# Altium project DAQ_REV_B.PrjPcb
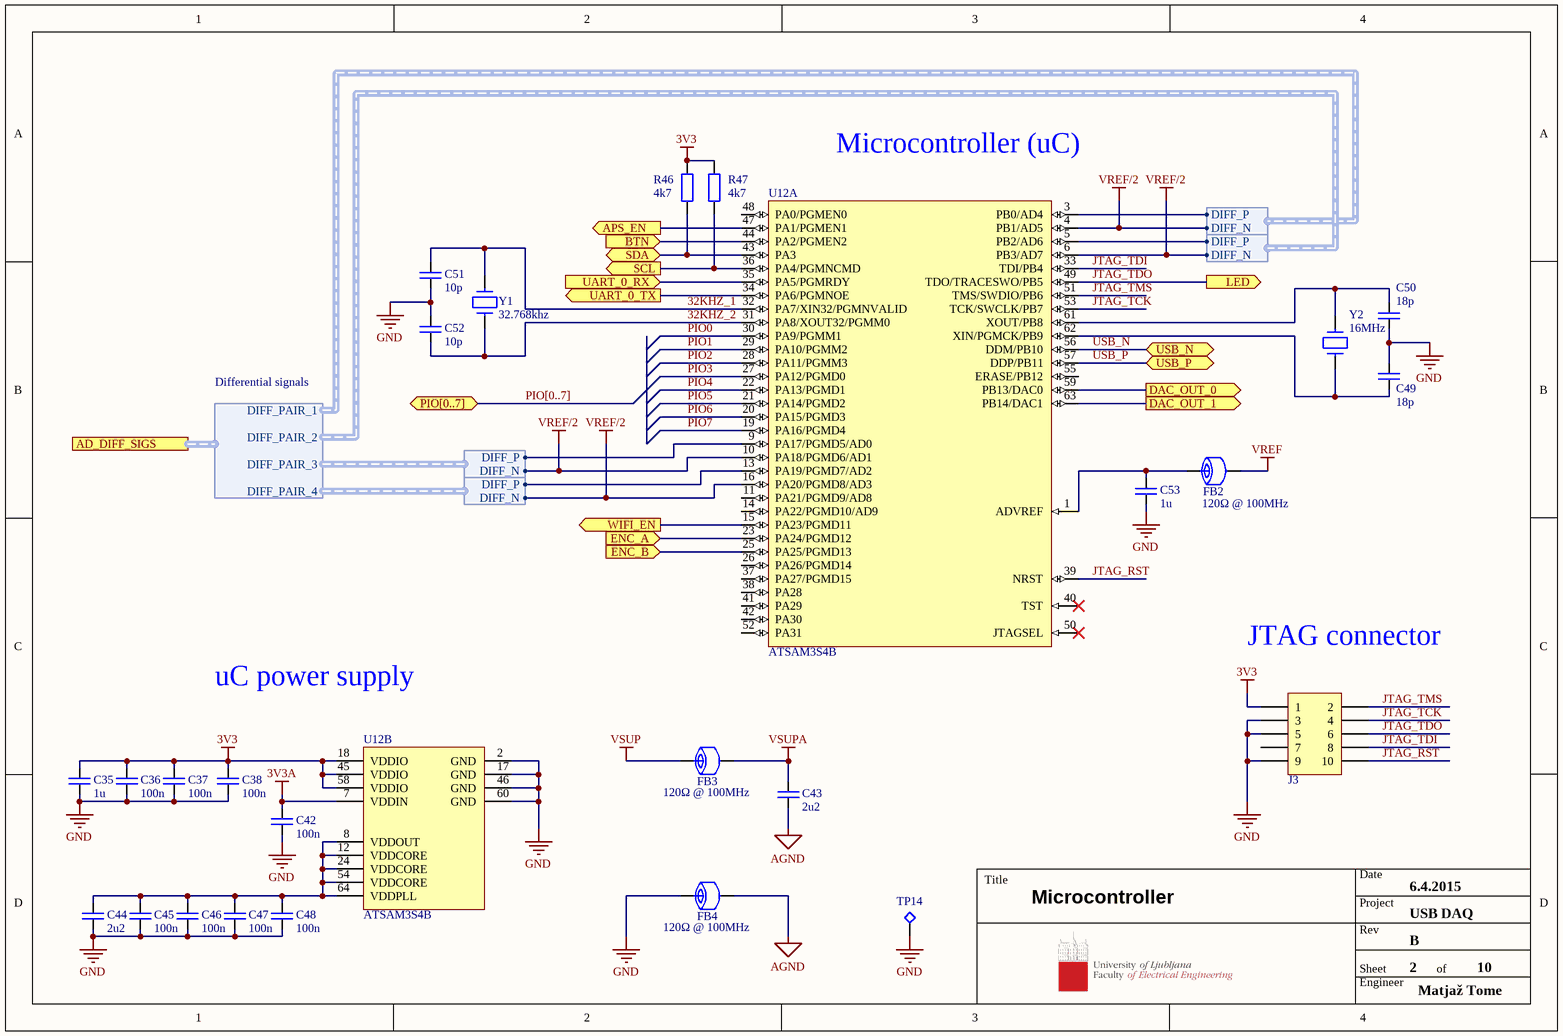
[diagram p0: Microcontroller.SchDoc]
4 sheets, 61 parts. Net scope: flat (ports and power ports of the same name join across sheets).
Board file: DAQ.PcbDoc
Sheets:
  Microcontroller.SchDoc
  Interfaces.SchDoc
  Output_amplifier.SchDoc
  Reference_voltage.SchDoc

## Sheet Microcontroller.SchDoc: Microcontroller
size A4; Date: 6.4.2015; Engineer: Matjaž Tome; DocumentNumber: 4; Revision: B; SheetNumber: 2; SheetTotal: 10; Project: USB DAQ

### Parts
C35  value 1u  [C_0603]  (hidden comment: comment)
C36  value 100n  [C_0603]  (hidden comment: comment)
C37  value 100n  [C_0603]  (hidden comment: comment)
C38  value 100n  [C_0603]  (hidden comment: comment)
C42  value 100n  [C_0603]  (hidden comment: comment)
C43  value 2u2  [C_0603]  (hidden comment: comment)
C44  value 2u2  [C_0603]  (hidden comment: comment)
C45  value 100n  [C_0603]  (hidden comment: comment)
C46  value 100n  [C_0603]  (hidden comment: comment)
C47  value 100n  [C_0603]  (hidden comment: comment)
C48  value 100n  [C_0603]  (hidden comment: comment)
C49  value 18p  [C_0603]  (hidden comment: comment)
C50  value 18p  [C_0603]  (hidden comment: comment)
C51  value 10p  [C_0603]  (hidden comment: comment)
C52  value 10p  [C_0603]  (hidden comment: comment)
C53  value 1u  [C_0603]  (hidden comment: comment)
FB2  120Ω @ 100MHz  [SMD_0805]
FB3  120Ω @ 100MHz  [SMD_0805]
FB4  120Ω @ 100MHz  [SMD_0805]
J3  M50-3600542  [HEADER_2X05_1.27mm]  (value not drawn)
R46  value 4k7  [R_0603]  (hidden comment: comment)
R47  value 4k7  [R_0603]  (hidden comment: comment)
TP14  testpoint  [TP1_FULL]  (value not drawn)
U12  ATSAM3S4B  [LQFP64]  (parts A,B of 2)
Y1  32.768khz  [2X6_FLAT]
Y2  16MHz  [5X3.2]

### Ports
AD_DIFF_SIGS (harness Differential signals), APS_EN (out), BTN (in), DAC_OUT_0 (out), DAC_OUT_1 (out), ENC_A (in), ENC_B (in), LED (out), PIO[0..7] (bidir), SCL (out), SDA (bidir), UART_0_RX (in), UART_0_TX (out), USB_N (bidir), USB_P (bidir), WIFI_EN (out)

### Harnesses
Differential pair: DIFF_P, DIFF_N
Differential signals: DIFF_PAIR_1, DIFF_PAIR_2, DIFF_PAIR_3, DIFF_PAIR_4

### Nets
3V3: C35.1 C36.1 C37.1 C38.1 J3.1 R46.2 R47.2 U12.18(VDDIO) U12.45(VDDIO) U12.58(VDDIO)
3V3A: C42.1 U12.7(VDDIN)
AGND: C43.2 FB4.2
GND: C35.2 C36.2 C37.2 C38.2 C42.2 C44.2 C45.2 C46.2 C47.2 C48.2 C49.2 C50.2 C51.2 C52.2 C53.2 FB4.1 J3.3 J3.5 J3.9 TP14.1 U12.2(GND) U12.17(GND) U12.46(GND) U12.60(GND)
VREF: FB2.2
VREF/2: U12.4(PB1/AD5) U12.6(PB3/AD7) U12.10(PA18/PGMD6/AD1) U12.16(PA20/PGMD8/AD3) ; harness Differential pair.DIFF_N
VSUP: FB3.1
VSUPA: C43.1 FB3.2
32KHZ_1: C51.1 U12.32(PA7/XIN32/PGMNVALID) Y1.2
32KHZ_2: C52.1 U12.31(PA8/XOUT32/PGMM0) Y1.1
APS_EN: U12.47(PA1/PGMEN1) ; port APS_EN
BTN: U12.44(PA2/PGMEN2) ; port BTN
DAC_OUT_0: U12.59(PB13/DAC0) ; port DAC_OUT_0
DAC_OUT_1: U12.63(PB14/DAC1) ; port DAC_OUT_1
ENC_A: U12.23(PA24/PGMD12) ; port ENC_A
ENC_B: U12.25(PA25/PGMD13) ; port ENC_B
JTAG_RST: J3.10 U12.39(NRST)
JTAG_TCK: J3.4 U12.53(TCK/SWCLK/PB7)
JTAG_TDI: J3.8 U12.33(TDI/PB4)
JTAG_TDO: J3.6 U12.49(TDO/TRACESWO/PB5) ; port LED
JTAG_TMS: J3.2 U12.51(TMS/SWDIO/PB6)
PIO0: U12.30(PA9/PGMM1)
PIO1: U12.29(PA10/PGMM2)
PIO2: U12.28(PA11/PGMM3)
PIO3: U12.27(PA12/PGMD0)
PIO4: U12.22(PA13/PGMD1)
PIO5: U12.21(PA14/PGMD2)
PIO6: U12.20(PA15/PGMD3)
PIO7: U12.19(PA16/PGMD4)
SCL: R47.1 U12.36(PA4/PGMNCMD) ; port SCL
SDA: R46.1 U12.43(PA3) ; port SDA
UART_0_RX: U12.35(PA5/PGMRDY) ; port UART_0_RX
UART_0_TX: U12.34(PA6/PGMNOE) ; port UART_0_TX
USB_N: U12.56(DDM/PB10) ; port USB_N
USB_P: U12.57(DDP/PB11) ; port USB_P
WIFI_EN: U12.15(PA23/PGMD11) ; port WIFI_EN
NetC44_1: C44.1 C45.1 C46.1 C47.1 C48.1 U12.8(VDDOUT) U12.12(VDDCORE) U12.24(VDDCORE) U12.54(VDDCORE) U12.64(VDDPLL)
NetC49_1: C49.1 U12.62(XIN/PGMCK/PB9) Y2.1
NetC50_1: C50.1 U12.61(XOUT/PB8) Y2.2
NetC53_1: C53.1 FB2.1 U12.1(ADVREF)
NetU12_3: U12.3(PB0/AD4) ; harness Differential pair.DIFF_P
NetU12_5: U12.5(PB2/AD6) ; harness Differential pair.DIFF_P
NetU12_9: U12.9(PA17/PGMD5/AD0) ; harness Differential pair.DIFF_P
NetU12_13: U12.13(PA19/PGMD7/AD2) ; harness Differential pair.DIFF_P

Not connected (* = marked no-connect by the designer): J3 7; U12 11(PA21/PGMD9/AD8) 14(PA22/PGMD10/AD9) 26(PA26/PGMD14) 37(PA27/PGMD15) 38(PA28) 40(TST)* 41(PA29) 42(PA30) 48(PA0/PGMEN0) 50(JTAGSEL)* 52(PA31) 55(ERASE/PB12)

### Buses and harness runs
bus PIO[0..7] = port PIO[0..7]

### Notes on the sheet
- Microcontroller (uC)
- JTAG connector
- uC power supply
- Title
- Date
- Project
- Rev
- Engineer
- Sheet
- of

### Library data of the parts
C35-C38 C42-C53 = Capacitor: Generic capacitor
FB2-FB4 = BLM21AG121SN1D: Ferrite Bead, 0805 [2012 Metric], 120 ohm, 800 mA, BLM21A Series, 0.15 ohm, ± 25%; Manufacturer: Murata; Dealer number: 1515617; Dealer: Farnell; DC resistance: 0.15Ω; Max current: 0.2A; Category: ferite beads; Price: 0.082; Manufacturer Number: BLM21AG121SN1D; AC resistance: 120Ω; Frequency: 100MHz; Case: 0805; Technology: SMT; HelpURL: https://www.farnell.com/datasheets/1914683.pdf
J3 = M50-3600542: Pin Header, Board-to-Board, 1.27 mm, 2 Rows, 10 Contacts, Surface Mount, Archer M50 Series; Manufacturer: Harwin; Dealer number: 1022310; Dealer: Farnell; Gender: Male; Rows: 2; Pitch: 1.27mm; Category: Connectors; Price: 0.90; Manufacturer Number: M50-3600542; Pins: 5; Orientation: strait; Technology: SMD; HelpURL: https://cdn.harwin.com/pdfs/M50-360.pdf
R46 R47 = Resistor: Generic resistor
TP14 = Test Point: testpoint 1.5mm diameter no hole; Part Number: XXC0006; Category: testpoints
U12 = ATSAM3SXB: Cortex M3 ARM microcontroller; Part Number: XAM0003; Manufacturer: Atmel; Manufacturer Number: ATSAM3S4BA-AU; Dealer number: 1841656; Dealer: Farnell; Core: Cortex-M3; Supply voltage max: 3.6V; Supply voltage min: 1.62V; Flash: 256kB; RAM: 48kB; GPIOs: 47; Timers: 3; ADCs: 8; SPI: 1; IIC: 2; Max Frequency: 64MHz; Category: Integrated circuits; Price: 6.58; UART: 3; Case: LQFP64; Technology: SMT; HelpURL: https://www.farnell.com/datasheets/1698183.pdf; Temperature range: -40°C to +85°C
Y1 = R26-32.768- 12.5: Crystal, 32.768 kHz, Cylinder Radial, 6.2mm x 2mm Dia, 12.5 pF, 20 ppm, R26 Series; Part Number: XCR0010; Manufacturer: RALTRON; Dealer number: 1652573; Dealer: Farnell; Value: 32.758khz; Load capacitance: 12pF; Frequency tolerance: 20ppm; Category: Crystals; Price: 0.18; Manufacturer Number: R26-32.768- 12.5; Technology: THT; Case: 5X3.2_1; HelpURL: http://www.ramitechnology.com/products/spec/crystal/crystal-r38_26_145.pdf
Y2 = 7A-16.000MAAJ-T: Crystal, 16 MHz, SMD, 5mm x 3.2mm, 30 ppm, 18 pF, 30 ppm, 7A Series; Manufacturer: TCX; Dealer number: 1841946; Dealer: Farnell; Load capacitance: 18pF; Frequency tolerance: 30ppm; Category: Crystals; Price: 0.91; Manufacturer Number: 7A-16.000MAAJ-T; Value: 16MHz; Technology: SMT; Case: 5X3.2; HelpURL: https://www.farnell.com/datasheets/1041607.pdf

## Sheet Interfaces.SchDoc: Interfaces
size A4; Date: 6.4.2015; Engineer: Matjaž Tome; DocumentNumber: 7; Revision: B; SheetNumber: 5; SheetTotal: 10; Project: USB DAQ
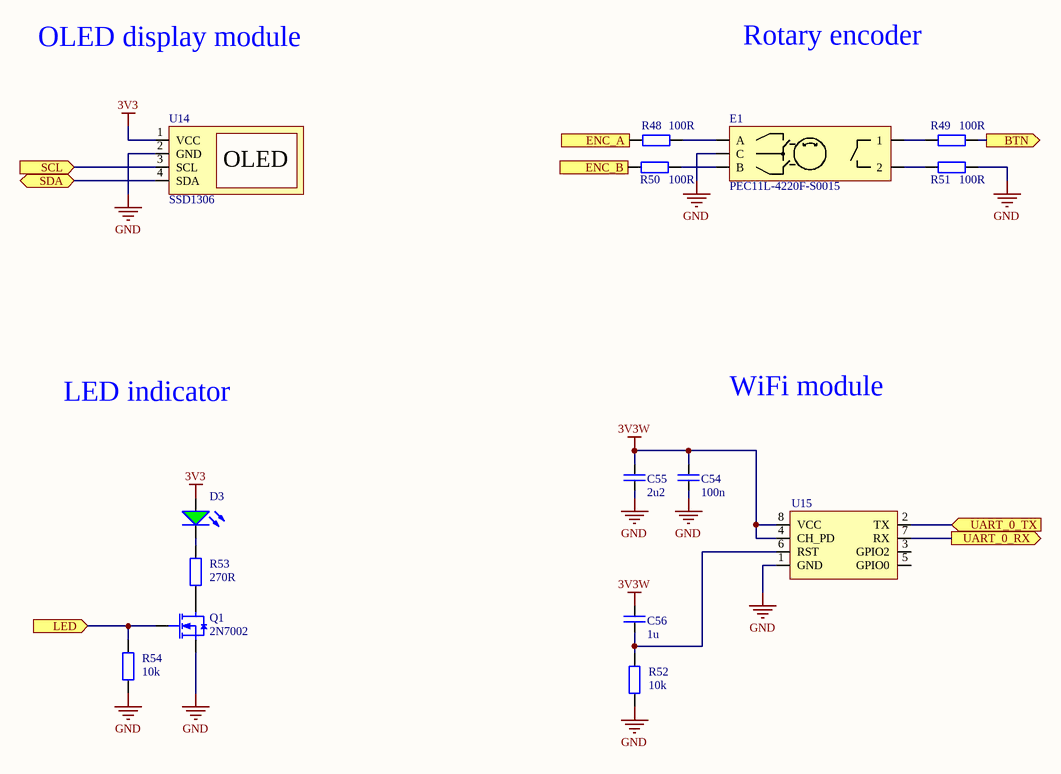
[diagram p1: Interfaces.SchDoc]

### Parts
C54  100n  [C_0603]
C55  2u2  [C_0603]
C56  1u  [C_0603]
D3  LED Green  [LED_0603]  (value not drawn)
E1  PEC11L-4220F-S0015  [PEC11L-4220F-S0015]
Q1  2N7002  [SOT23-3]
R48  value 100R  [R_0603]  (hidden comment: comment)
R49  value 100R  [R_0603]  (hidden comment: comment)
R50  value 100R  [R_0603]  (hidden comment: comment)
R51  value 100R  [R_0603]  (hidden comment: comment)
R52  value 10k  [R_0603]  (hidden comment: comment)
R53  value 270R  [R_0603]  (hidden comment: comment)
R54  value 10k  [R_0603]  (hidden comment: comment)
U14  SSD1306  [OLED1]
U15  ESP-01  [ESP-01]  (value not drawn)

### Ports
BTN (out), ENC_A (out), ENC_B (out), LED (in), SCL (in), SDA (bidir), UART_0_RX (out), UART_0_TX (in)

### Nets
3V3: D3.2(+) U14.1(VCC)
3V3W: C54.2 C55.2 C56.2 U15.4(CH_PD) U15.8(VCC)
GND: C54.1 C55.1 E1.C Q1.2(S) R51.2 R52.1 R54.1 U14.2(GND) U15.1(GND)
BTN: R49.2 ; port BTN
ENC_A: R48.1 ; port ENC_A
ENC_B: R50.1 ; port ENC_B
JTAG_TDO: Q1.1(G) R54.2 ; port LED
SCL: U14.3(SCL) ; port SCL
SDA: U14.4(SDA) ; port SDA
UART_0_RX: U15.7(RX) ; port UART_0_RX
UART_0_TX: U15.2(TX) ; port UART_0_TX
NetC56_1: C56.1 R52.2 U15.6(RST)
NetD3_1: D3.1(-) R53.2
NetE1_1: E1.1 R49.1
NetE1_2: E1.2 R51.1
NetE1_A: E1.A R48.2
NetE1_B: E1.B R50.2
NetQ1_3: Q1.3(D) R53.1

Not connected (* = marked no-connect by the designer): U15 3(GPIO2) 5(GPIO0)

### Notes on the sheet
- Rotary encoder
- OLED display module
- LED indicator
- WiFi module
- Title
- Date
- Project
- Rev
- Engineer
- Sheet
- of
- (in symbol OLED_SSD1306) OLED

### Library data of the parts
C54-C56 = Capacitor: Generic capacitor
  C54: Value: 100n
  C55: Value: 2u2
  C56: Value: 1u
D3 = LED Green: Generic LED Green
E1 = PEC11L-4220F-S0015: Low Profile Encoder 15 PPR 2 Bit Quadrature 5VDC at 10 mA IP40 PCB Mount; Part Number: XRE0000; Manufacturer: BOURNS; Dealer number: 652-PEC11L4220FS0015; Dealer: Mouser; Category: Rotary encoders; Price: 1.51; Technology: SMT; Manufacturer Number: PEC11L-4220F-S0015; HelpURL: https://www.farnell.com/datasheets/2259386.pdf
Q1 = 2N7002: 60V 0.3A N-channel MOSFET; Part Number: XMN0002; Manufacturer: NXP; Dealer number: 1510761; Dealer: Farnell; RDS: 2.8Ω; Max power disipation: 830mW; Type: N-enhancment mode; Logic level: Yes; Category: mosfets; Price: 0.039; Manufacturer Number: 2N7002; Max voltage: 60V; Max current: 0.3A; Case: SOT23-3; Technology: SMT; HelpURL: https://www.farnell.com/datasheets/1499179.pdf; SKU: 5000000000001
R48-R54 = Resistor: Generic resistor
U14 = OLED_SSD1306: Oled display module; Part Number: OLM0000; Dealer: Ebay; Category: Displays; Price: 7; Technology: THT; HelpURL: https://cdn-shop.adafruit.com/datasheets/SSD1306.pdf
U15 = ESP-01: WIFI module; Part Number: XWM0000; Dealer: Ebay; Category: WIFI modules; Price: 3.8; Technology: THT; HelpURL: https://en.wikipedia.org/wiki/ESP8266

## Sheet Output_amplifier.SchDoc: DAC output amplifier
size A4; Date: 6.4.2015; Engineer: Matjaž Tome; Revision: B; SheetNumber: 8; SheetTotal: 10; Project: USB DAQ
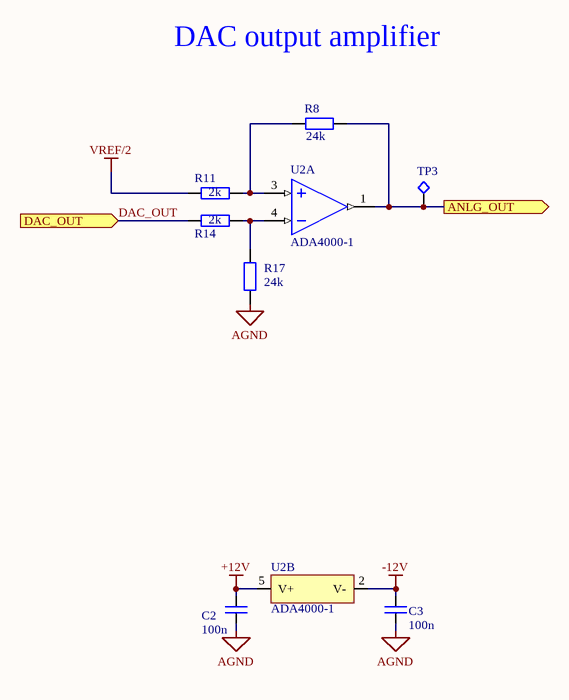
[diagram p2: Output_amplifier.SchDoc]

### Parts
C2  100n  [C_0603]
C3  100n  [C_0603]
R8  value 24k  [R_0603]  (hidden comment: comment)
R11  value 2k  [R_0603]  (hidden comment: comment)
R14  value 2k  [R_0603]  (hidden comment: comment)
R17  value 24k  [R_0603]  (hidden comment: comment)
TP3  testpoint  [TP1_FULL]  (value not drawn)
U2  ADA4000-1  [SOT23-5]  (parts A,B of 2)

### Ports
ANLG_OUT (out), DAC_OUT (in)

### Nets
+12V: C2.1 U2.5(V+)
-12V: C3.1 U2.2(V-)
AGND: C2.2 C3.2 R17.1
VREF/2: R11.1
ANLG_OUT: R8.2 TP3.1 U2.1(OUT) ; port ANLG_OUT
DAC_OUT: R14.1 ; port DAC_OUT
NetR8_1: R8.1 R11.2 U2.3(IN+)
NetR14_2: R14.2 R17.2 U2.4(IN-)

### Notes on the sheet
- DAC output amplifier
- Title
- Date
- Project
- Rev
- Engineer
- Sheet
- of

### Library data of the parts
C2 C3 = Capacitor: Generic capacitor; Value: 100n
R8 R11 R14 R17 = Resistor: Generic resistor
TP3 = Test Point: as TP14 on sheet Microcontroller; Category: testpoints
U2 = ADA4000-1: Operational Amplifier, Single, 1 Amplifier, 5 MHz, 20 V/µs, ± 4V to ± 18V, TSOT, 5 Pins; Part Number: XOG0003; Manufacturer: Analog devices; Manufacturer Number: ADA4000-1AUJZ-R7; Dealer number: 2461002; Dealer: Farnell; Supply voltage max: +-18V; Devices: 1; Category: Integrated circuits; Price: 1.97; Case: SOT; Technology: SMT; HelpURL: https://www.farnell.com/datasheets/698265.pdf

## Sheet Reference_voltage.SchDoc: Reference voltage
size A4; Date: 6.4.2015; Engineer: Matjaž Tome; Revision: B; SheetNumber: 9; SheetTotal: 10; Project: USB DAQ
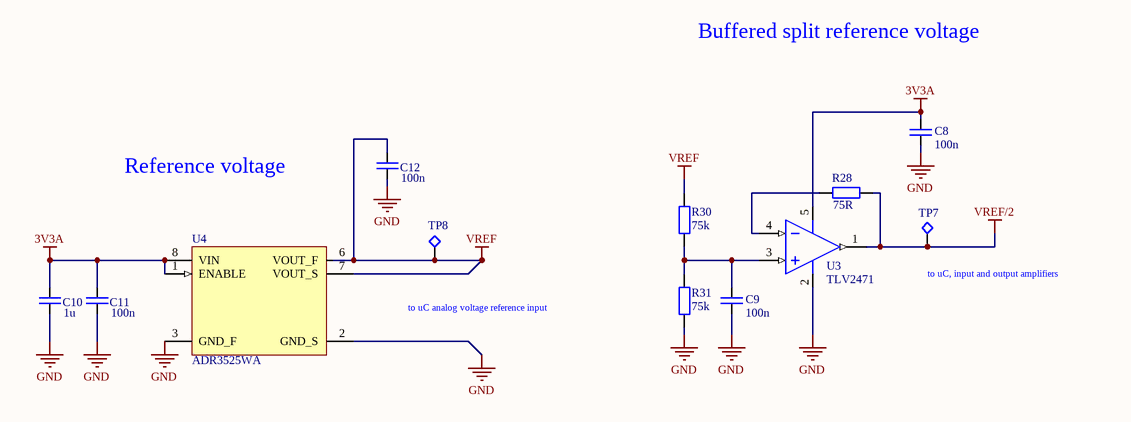
[diagram p3: Reference_voltage.SchDoc]

### Parts
C8  value 100n  [C_0603]  (hidden comment: comment)
C9  value 100n  [C_0603]  (hidden comment: comment)
C10  value 1u  [C_0603]  (hidden comment: comment)
C11  value 100n  [C_0603]  (hidden comment: comment)
C12  value 100n  [C_0603]  (hidden comment: comment)
R28  value 75R  [R_0603]  (hidden comment: comment)
R30  value 75k  [R_0603]  (hidden comment: comment)
R31  value 75k  [R_0603]  (hidden comment: comment)
TP7  testpoint  [TP1_FULL]  (value not drawn)
TP8  testpoint  [TP1_FULL]  (value not drawn)
U3  TLV2471  [SOT23-5]
U4  ADR3525WA  [MSOP8]

### Nets
3V3A: C8.2 C10.1 C11.1 U3.5(V+) U4.1(ENABLE) U4.8(VIN)
GND: C8.1 C9.2 C10.2 C11.2 C12.2 R31.1 U3.2(V-) U4.2(GND_S) U4.3(GND_F)
VREF: C12.1 R30.2 TP8.1 U4.6(VOUT_F) U4.7(VOUT_S)
VREF/2: R28.2 TP7.1 U3.1(OUT_A)
NetC9_1: C9.1 R30.1 R31.2 U3.3(+IN_A)
NetR28_1: R28.1 U3.4(-IN_A)

### Notes on the sheet
- Buffered split reference voltage
- Reference voltage
- (near TP7) to uC, input and output amplifiers
- to uC analog voltage reference input
- Title
- Date
- Project
- Rev
- Engineer
- Sheet
- of

### Library data of the parts
C8-C12 = Capacitor: Generic capacitor
R28 R30 R31 = Resistor: Generic resistor
TP7 TP8 = Test Point: as TP14 on sheet Microcontroller; Category: testpoints
U3 = TLV2471: FAMILY OF 600μA/Ch 2.8MHz RAIL-TO-RAIL INPUT/OUTPUT / HIGH-DRIVE OPERATIONAL AMPLIFIERS WITH SHUTDOWN; Part Number: XOG0002; Manufacturer: Texas Instruments; Manufacturer Number: TLV2471IDBVT; Dealer number: 1102964; Dealer: Farnell; Supply voltage max: 6V; Supply voltage min: 2.7V; Devices: 1; Rail to Rail: IN/OUT; Category: Integrated circuits; Price: 1.43; GBP: 2.8MHz; Case: SOT23-5; Technology: SMT; HelpURL: http://www.ti.com/general/docs/suppproductinfo.tsp?distId=26&gotoUrl=http%3A%2F%2Fwww.ti.com%2Flit%2Fgpn%2Ftlv2471
U4 = ADR3525W: Precision Voltage References 2.5V CMOS 8ppm/C; Part Number: VRX0002; Manufacturer: Analog devices; Manufacturer Number: ADR3525WARMZ-R7; Dealer number: 584-ADR3525WARMZ-R7; Dealer: Mouser; Max input voltage: 5.5V; Output current: 10mA; Voltage tolerance: 0.1%; Category: Integrated circuits; Price: 1.66; Output Voltage: 2.5V; Case: MSOP8; Technology: SMT; HelpURL: https://www.farnell.com/datasheets/1511785.pdf

## Nets that join several sheets
3V3: Microcontroller (10 pins), Interfaces (D3.2 U14.1)
3V3A: Microcontroller (C42.1 U12.7), Reference_voltage (6 pins)
AGND: Microcontroller (C43.2 FB4.2), Output_amplifier (C2.2 C3.2 R17.1)
GND: Microcontroller (24 pins), Interfaces (9 pins), Reference_voltage (9 pins)
VREF: Microcontroller (FB2.2), Reference_voltage (5 pins)
VREF/2: Microcontroller (U12.4 U12.6 U12.10 U12.16), Output_amplifier (R11.1), Reference_voltage (R28.2 TP7.1 U3.1)
BTN: Microcontroller (U12.44), Interfaces (R49.2)
ENC_A: Microcontroller (U12.23), Interfaces (R48.1)
ENC_B: Microcontroller (U12.25), Interfaces (R50.1)
JTAG_TDO: Microcontroller (J3.6 U12.49), Interfaces (Q1.1 R54.2)
SCL: Microcontroller (R47.1 U12.36), Interfaces (U14.3)
SDA: Microcontroller (R46.1 U12.43), Interfaces (U14.4)
UART_0_RX: Microcontroller (U12.35), Interfaces (U15.7)
UART_0_TX: Microcontroller (U12.34), Interfaces (U15.2)